# Altium schematic sheet BBB-Supply.SchDoc
size OrCAD A
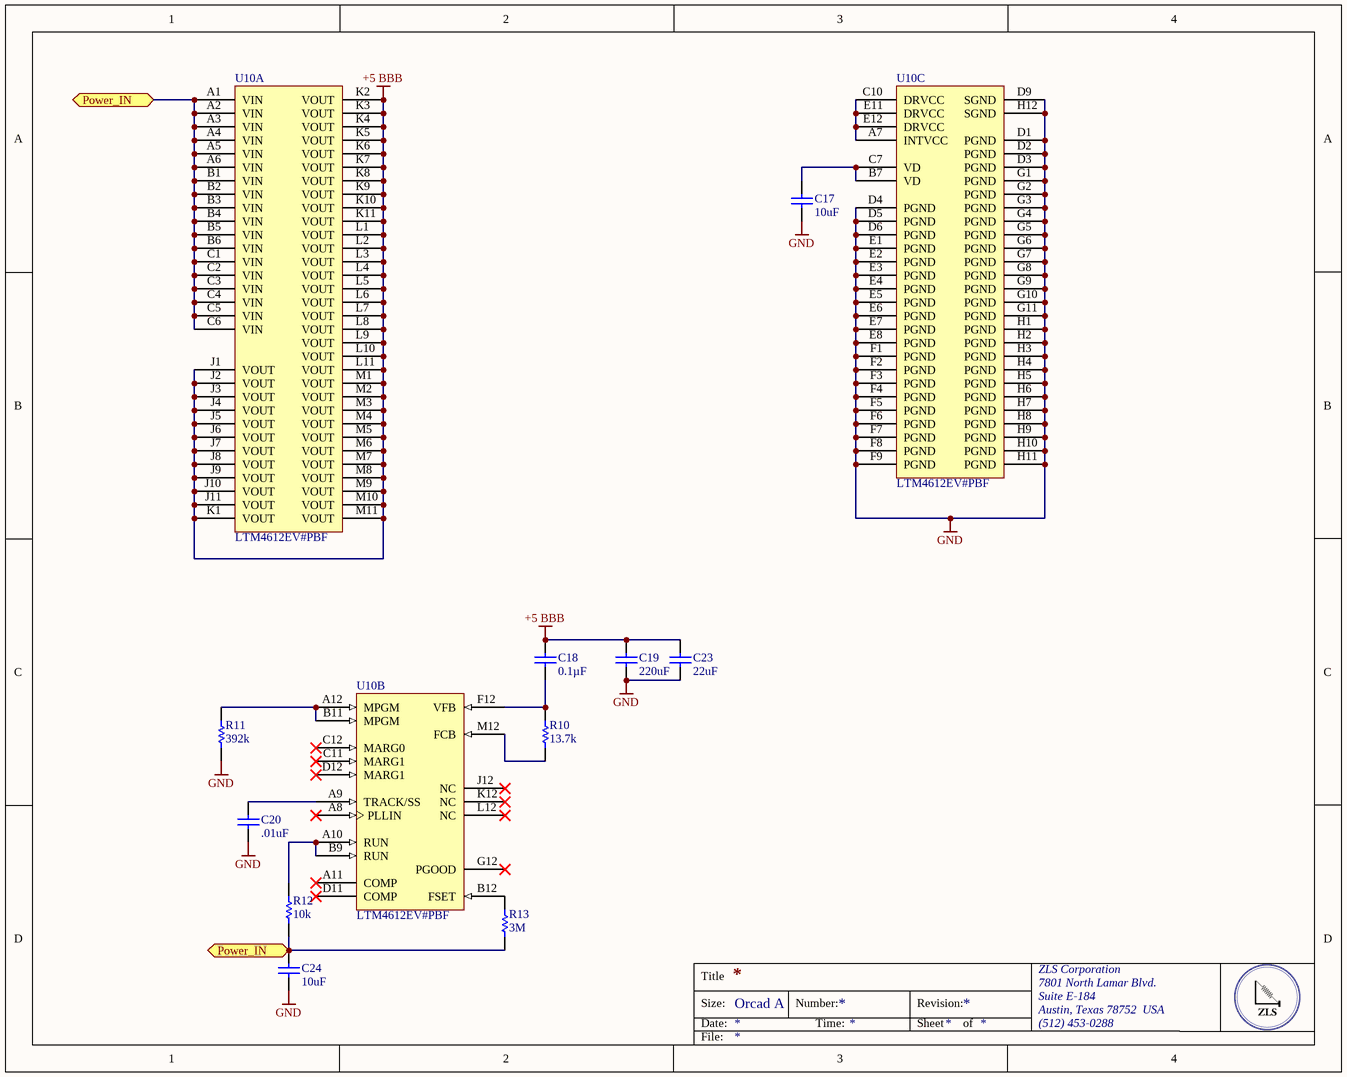
[diagram p0: BBB-Supply.SchDoc]

## Parts
C17  Capacitance: 10uF  [CAPC0805(2012)145_N]  (hidden comment: CAP CER 0.1UF 16V X7R 0805)
C18  Capacitance: 0.1µF  [CAPC0805(2012)145_N]  (hidden comment: CAP CER 0.1UF 16V X7R 0805)
C19  Capacitance: 220uF  [CAPC0805(2012)145_N]  (hidden comment: CAP CER 0.1UF 16V X7R 0805)
C20  Capacitance: .01uF  [CAPC0805(2012)145_N]  (hidden comment: CAP CER 0.1UF 16V X7R 0805)
C23  Capacitance: 22uF  [CAPC0805(2012)145_N]  (hidden comment: CAP CER 0.1UF 16V X7R 0805)
C24  Capacitance: 10uF  [CAPC0805(2012)145_N]  (hidden comment: CAP CER 0.1UF 16V X7R 0805)
R10  Resistance (Ohms): 13.7k  [RESC0805(2012)_M]  (hidden comment: RES SMD 43K OHM 1% 1/8W 0805)
R11  Resistance (Ohms): 392k  [RESC0805(2012)_M]  (hidden comment: RES SMD 43K OHM 1% 1/8W 0805)
R12  Resistance (Ohms): 10k  [RESC0805(2012)_M]  (hidden comment: RES SMD 43K OHM 1% 1/8W 0805)
R13  Resistance (Ohms): 3M  [RESC0805(2012)_M]  (hidden comment: RES SMD 43K OHM 1% 1/8W 0805)
U10  LTM4612EV#PBF  [LT-LGA-133-05-08-1766_V]  (parts A,B,C of 3)

## Ports
Power_IN

## Nets
+5 BBB: C18.2 C19.2 C23.2 U10.J1(VOUT) U10.J2(VOUT) U10.J3(VOUT) U10.J4(VOUT) U10.J5(VOUT) U10.J6(VOUT) U10.J7(VOUT) U10.J8(VOUT) U10.J9(VOUT) U10.J10(VOUT) U10.J11(VOUT) U10.K1(VOUT) U10.K2(VOUT) U10.K3(VOUT) U10.K4(VOUT) U10.K5(VOUT) U10.K6(VOUT) U10.K7(VOUT) U10.K8(VOUT) U10.K9(VOUT) U10.K10(VOUT) U10.K11(VOUT) U10.L1(VOUT) U10.L2(VOUT) U10.L3(VOUT) U10.L4(VOUT) U10.L5(VOUT) U10.L6(VOUT) U10.L7(VOUT) U10.L8(VOUT) U10.L9(VOUT) U10.L10(VOUT) U10.L11(VOUT) U10.M1(VOUT) U10.M2(VOUT) U10.M3(VOUT) U10.M4(VOUT) U10.M5(VOUT) U10.M6(VOUT) U10.M7(VOUT) U10.M8(VOUT) U10.M9(VOUT) U10.M10(VOUT) U10.M11(VOUT)
GND: C17.1 C19.1 C20.1 C23.1 C24.1 R11.1 U10.D1(PGND) U10.D2(PGND) U10.D3(PGND) U10.D4(PGND) U10.D5(PGND) U10.D6(PGND) U10.D9(SGND) U10.E1(PGND) U10.E2(PGND) U10.E3(PGND) U10.E4(PGND) U10.E5(PGND) U10.E6(PGND) U10.E7(PGND) U10.E8(PGND) U10.F1(PGND) U10.F2(PGND) U10.F3(PGND) U10.F4(PGND) U10.F5(PGND) U10.F6(PGND) U10.F7(PGND) U10.F8(PGND) U10.F9(PGND) U10.G1(PGND) U10.G2(PGND) U10.G3(PGND) U10.G4(PGND) U10.G5(PGND) U10.G6(PGND) U10.G7(PGND) U10.G8(PGND) U10.G9(PGND) U10.G10(PGND) U10.G11(PGND) U10.H1(PGND) U10.H2(PGND) U10.H3(PGND) U10.H4(PGND) U10.H5(PGND) U10.H6(PGND) U10.H7(PGND) U10.H8(PGND) U10.H9(PGND) U10.H10(PGND) U10.H11(PGND) U10.H12(SGND)
Power_IN: C24.2 R12.1 R13.1 U10.A1(VIN) U10.A2(VIN) U10.A3(VIN) U10.A4(VIN) U10.A5(VIN) U10.A6(VIN) U10.B1(VIN) U10.B2(VIN) U10.B3(VIN) U10.B4(VIN) U10.B5(VIN) U10.B6(VIN) U10.C1(VIN) U10.C2(VIN) U10.C3(VIN) U10.C4(VIN) U10.C5(VIN) U10.C6(VIN) ; port Power_IN
NetC17_2: C17.2 U10.B7(VD) U10.C7(VD)
NetC18_1: C18.1 R10.1 U10.F12(VFB)
NetC20_2: C20.2 U10.A9(TRACK/SS)
NetR10_2: R10.2 U10.M12(FCB)
NetR11_2: R11.2 U10.A12(MPGM) U10.B11(MPGM)
NetR12_2: R12.2 U10.A10(RUN) U10.B9(RUN)
NetR13_2: R13.2 U10.B12(FSET)
NetU10_A7: U10.A7(INTVCC) U10.C10(DRVCC) U10.E11(DRVCC) U10.E12(DRVCC)

Not connected (* = marked no-connect by the designer): U10 A8(PLLIN)* A11(COMP)* C11(MARG1)* C12(MARG0)* D11(COMP)* D12(MARG1)* G12(PGOOD)* J12(NC)* K12(NC)* L12(NC)*

## Notes on the sheet
- Title
- Size:
- Date:
- Orcad A
- Number:
- Time:
- Revision:
- Sheet
- of
- ZLS Corporation
- 7801 North Lamar Blvd.
- Suite E-184
- Austin, Texas 78752  USA
- (512) 453-0288
- File:

## Library data of the parts
C17-C20 C23 C24 = CMP-1036-04795-1: Manufacturer: Murata Electronics North America; Manufacturer Part Number: GRM219R71C104KA01D; Tolerance: ±10%; Voltage - Rated: 25V; Supplier Part Number 1: 490-1673-6-ND; Temperature Coefficient: X7R; Thickness (Max): 0.053" (1.35mm); Supplier 2: Digi-Key; Supplier Part Number 2: 490-1683-6-ND; RoHS: RoHS Compliant; Category: Capacitors; Stock 2: 245331; Pricing 2: 1=0.14, 10=0.098, 100=0.0462, 500=0.0324, 1000=0.02683 (USD); Packaging: Digi-Reel®; Part Status: Active; Operating Temperature: -55°C ~ 125°C; Features: -; Ratings: -; Applications: General Purpose; Mounting Type: Surface Mount, MLCC; Package / Case: 0805 (2012 Metric); Size / Dimension: 0.079" L x 0.049" W (2.00mm x 1.25mm); Height - Seated (Max): -; Lead Spacing: -; Lead Style: -; ComponentLink1URL: http://www.murata.com/~/media/webrenewal/support/library/catalog/products/capacitor/mlcc/c02e.ashx; ComponentLink1Description: http://www.murata.com/~/media/webrenewal/support/library/catalog/products/capacitor/mlcc/c02e.ashx
R10-R13 = CMP-1013-00017-1: RES SMD 10K OHM 1% 1/8W 0805
U10 = CMP-0483-00080-1: EN55022B Compliant 36 VIN, 15 VOUT, 5 A, DC/DC uModule Regulator, 133-pin LGA, -40 to 125 degC, Pb-Free, Tray; Manufacturer: Linear Technology; Isupply(mA): 4.5; Tracking: yes; Frequency(kHz): 940; Frequency Sync Range: 200kHz - 1.3MHz; Vin Min(V): 5; Switch Current(A): 9; Vout Min(V): 3.3; Vout Max(V): 15; Number of Outputs: 1; Extended Temp: E, I, MP; Vin Max(V): 36; Ishutdown(uA): 50; Topology: Buck; Packing: Tray; PackageReference: LGA-133; ComponentLink3URL: http://cds.linear.com/docs/en/packaging/05081766_A_lga133.pdf; Code_JEDEC: MO-222; DatasheetVersion: Rev. B; PartNumber: LTM4612EV#PBF; Synchronous: yes; RoHS: TRUE; Mounting Technology: Surface Mount; ComponentLink1URL: http://www.linear.com/; ComponentLink2URL: http://cds.linear.com/docs/en/datasheet/4612fb.pdf; ComponentLink1Description: Manufacturer URL; PackageDescription: 133-Pin LGA, Body 15 x 15 mm, Pitch 1.27 mm; ComponentLink3Description: Package Specification; PackageVersion: Rev. A, 02/2013; ComponentLink2Description: Datasheet; Output Current(A): 5; PartId: 1